# Altium schematic sheet POWER_SUPPLY_2.SchDoc: Power Supply
size A3; DocumentNumber: 9; SheetNumber: 9; SheetTotal: 12
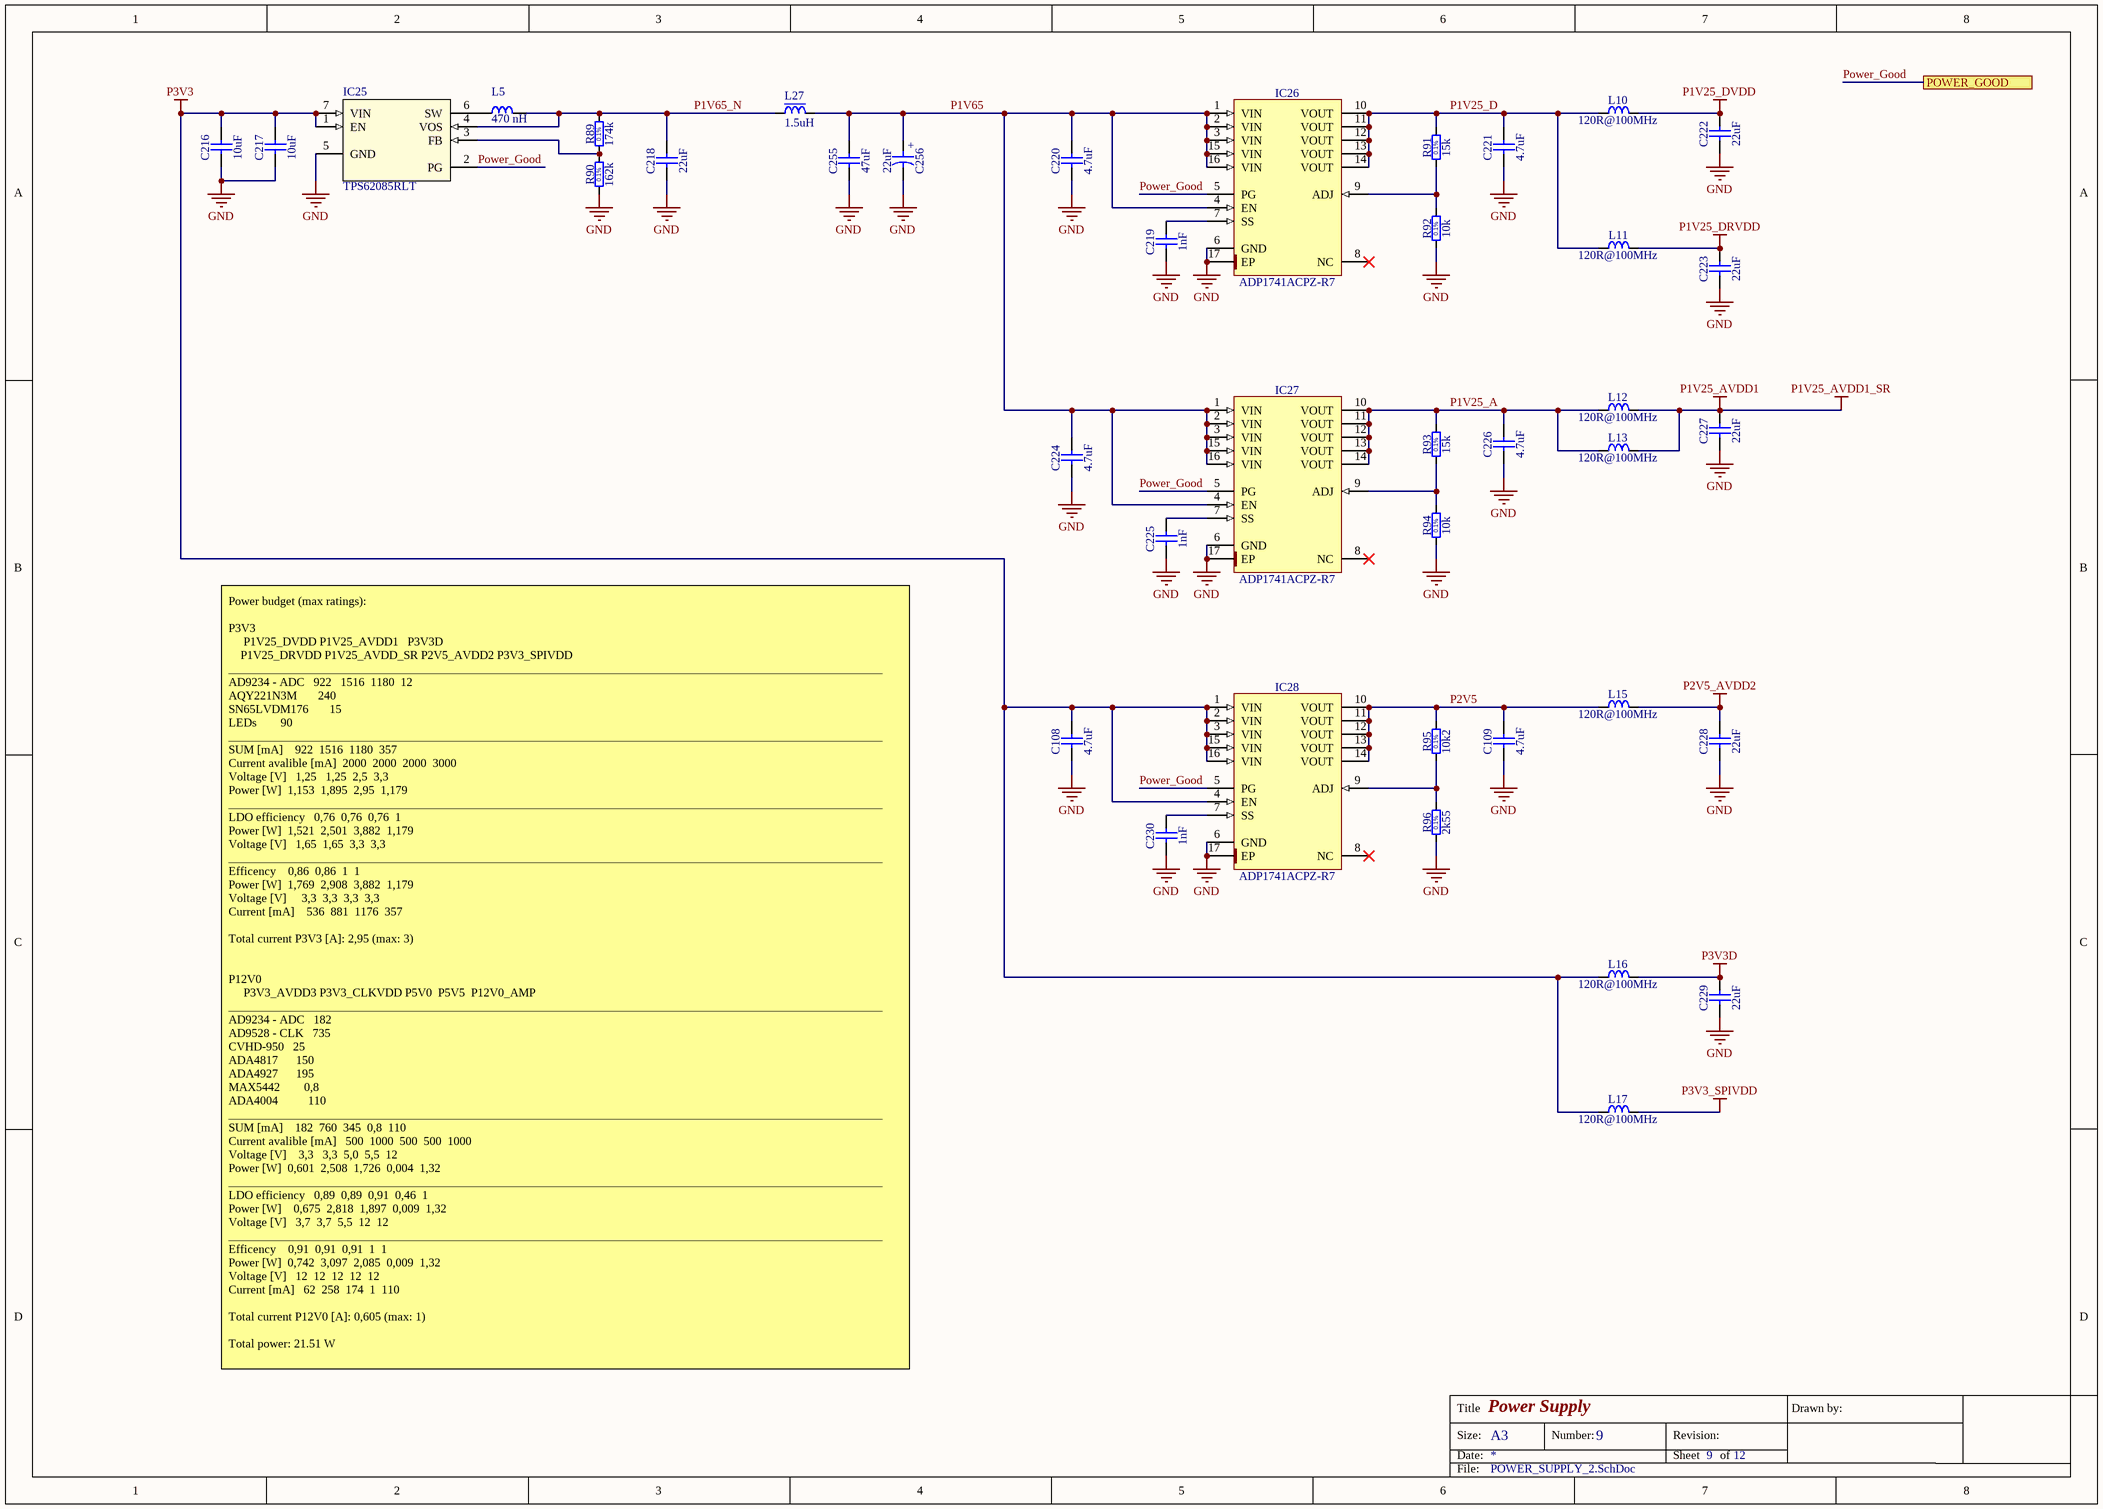
[diagram p0: POWER_SUPPLY_2.SchDoc]

## Parts
C108  4.7uF  [CAPC1709X95N]
C109  4.7uF  [CAPC1709X95N]
C216  10uF  [CAPC1608X87N]
C217  10uF  [CAPC1608X87N]
C218  22uF  [CAPC2012X95N]
C219  1nF  [CAPC0603X33N]
C220  4.7uF  [CAPC1709X95N]
C221  4.7uF  [CAPC1709X95N]
C222  22uF  [CAPC1709X100N]
C223  22uF  [CAPC1709X100N]
C224  4.7uF  [CAPC1709X95N]
C225  1nF  [CAPC0603X33N]
C226  4.7uF  [CAPC1709X95N]
C227  22uF  [CAPC1709X100N]
C228  22uF  [CAPC1709X100N]
C229  22uF  [CAPC1709X100N]
C230  1nF  [CAPC0603X33N]
C255  47uF  [CAPC3225X270N]
C256  22uF  [CAPMP3528X210N]
IC25  TPS62085RLT  [RLT0007A]
IC26  ADP1741ACPZ-R7  [QFN65P400X400X100-17N-S225]
IC27  ADP1741ACPZ-R7  [QFN65P400X400X100-17N-S225]
IC28  ADP1741ACPZ-R7  [QFN65P400X400X100-17N-S225]
L5  470 nH  [IND_IHLP-1212AE]
L10  120R@100MHz  [INDC1608X65N]
L11  120R@100MHz  [INDC1608X65N]
L12  120R@100MHz  [INDC1608X65N]
L13  120R@100MHz  [INDC1608X65N]
L15  120R@100MHz  [INDC1608X65N]
L16  120R@100MHz  [INDC1608X65N]
L17  120R@100MHz  [INDC1608X65N]
L27  1.5uH  [IND_SPM4020]
R89  174k  [RESC2012X60N]
R90  162k  [RESC2012X60N]
R91  15k  [RESC1608X55N]
R92  10k  [RESC1608X55N]
R93  15k  [RESC1608X55N]
R94  10k  [RESC1608X55N]
R95  10k2  [RESC1608X55N]
R96  2k55  [RESC1608X55N]

## Ports
POWER_GOOD

## Nets
GND: C108.1 C109.1 C216.1 C217.1 C218.1 C219.1 C220.1 C221.1 C222.1 C223.1 C224.1 C225.1 C226.1 C227.1 C228.1 C229.1 C230.1 C255.1 C256.2 IC25.5(GND) IC26.6(GND) IC26.17(EP) IC27.6(GND) IC27.17(EP) IC28.6(GND) IC28.17(EP) R90.1 R92.1 R94.1 R96.1
P1V25_AVDD1: C227.2 L12.2 L13.2  [also labelled P1V25_AVDD1_SR]
P1V25_DRVDD: C223.2 L11.2
P1V25_DVDD: C222.2 L10.2
P2V5_AVDD2: C228.2 L15.2
P3V3: C108.2 C216.2 C217.2 IC25.1(EN) IC25.7(VIN) IC28.1(VIN) IC28.2(VIN) IC28.3(VIN) IC28.4(EN) IC28.15(VIN) IC28.16(VIN) L16.1 L17.1
P3V3_SPIVDD: L17.2
P3V3D: C229.2 L16.2
P1V25_A: C226.2 IC27.10(VOUT) IC27.11(VOUT) IC27.12(VOUT) IC27.13(VOUT) IC27.14(VOUT) L12.1 L13.1 R93.2
P1V25_D: C221.2 IC26.10(VOUT) IC26.11(VOUT) IC26.12(VOUT) IC26.13(VOUT) IC26.14(VOUT) L10.1 L11.1 R91.2
P1V65: C220.2 C224.2 C255.2 C256.1 IC26.1(VIN) IC26.2(VIN) IC26.3(VIN) IC26.4(EN) IC26.15(VIN) IC26.16(VIN) IC27.1(VIN) IC27.2(VIN) IC27.3(VIN) IC27.4(EN) IC27.15(VIN) IC27.16(VIN) L27.2
P1V65_N: C218.2 IC25.4(VOS) L5.1 L27.1 R89.2
P2V5: C109.2 IC28.10(VOUT) IC28.11(VOUT) IC28.12(VOUT) IC28.13(VOUT) IC28.14(VOUT) L15.1 R95.2
Power_Good: IC25.2(PG) IC26.5(PG) IC27.5(PG) IC28.5(PG) ; port POWER_GOOD
NetC219_2: C219.2 IC26.7(SS)
NetC225_2: C225.2 IC27.7(SS)
NetC230_2: C230.2 IC28.7(SS)
NetIC25_3: IC25.3(FB) R89.1 R90.2
NetIC25_6: IC25.6(SW) L5.2
NetIC26_9: IC26.9(ADJ) R91.1 R92.2
NetIC27_9: IC27.9(ADJ) R93.1 R94.2
NetIC28_9: IC28.9(ADJ) R95.1 R96.2

Not connected (* = marked no-connect by the designer): IC26 8(NC)*; IC27 8(NC)*; IC28 8(NC)*

## Notes on the sheet
- Power budget (max ratings):
  P3V3
  P1V25_DVDD	P1V25_AVDD1			P3V3D
  P1V25_DRVDD	P1V25_AVDD_SR	P2V5_AVDD2	P3V3_SPIVDD
  _____________________________________________________________________________________________________________
  AD9234 - ADC	  922 		1516		1180		12
  AQY221N3M							240
  SN65LVDM176							15
  LEDs								90
  _____________________________________________________________________________________________________________
  SUM [mA]	   922		1516		1180		357
  Current avalible [mA]  2000		2000		2000		3000
  Voltage [V]	  1,25 		1,25		2,5		3,3
  Power [W]		1,153		1,895		2,95		1,179
  _____________________________________________________________________________________________________________
  LDO efficiency	  0,76		0,76		0,76		1
  Power [W]		1,521		2,501		3,882		1,179
  Voltage [V]	  1,65		1,65		3,3		3,3
  _____________________________________________________________________________________________________________
  Efficency		  0,86		0,86		1		1
  Power [W]		1,769		2,908		3,882		1,179
  Voltage [V]	    3,3		3,3		3,3		3,3
  Current [mA]	   536		881		1176		357
  Total current P3V3 [A]: 2,95 (max: 3)
  P12V0
  P3V3_AVDD3	P3V3_CLKVDD	P5V0		P5V5		P12V0_AMP	_____________________________________________________________________________________________________________
  AD9234 - ADC	  182
  AD9528 - CLK			735
  CVHD-950			25
  ADA4817						150
  ADA4927						195
  MAX5442								0,8
  ADA4004										110
  _____________________________________________________________________________________________________________
  SUM [mA]	   182		760		345		0,8		110
  Current avalible [mA]   500		1000		500		500		1000
  Voltage [V]	   3,3 		3,3		5,0		5,5		12
  Power [W]		0,601		2,508		1,726		0,004		1,32
  _____________________________________________________________________________________________________________
  LDO efficiency	  0,89		0,89		0,91		0,46		1
  Power [W]	 	 0,675		2,818		1,897		0,009		1,32
  Voltage [V]	  3,7		3,7		5,5		12		12
  _____________________________________________________________________________________________________________
  Efficency		  0,91		0,91		0,91		1		1
  Power [W]		0,742		3,097		2,085		0,009		1,32
  Voltage [V]	  12		12		12		12		12
  Current [mA]	  62		258		174		1		110
  Total current P12V0 [A]: 0,605 (max: 1)
  Total power: 21.51 W
- Title
- Size:
- Date:
- A3
- Number:
- Revision:
- Sheet
- of
- Drawn by:
- File:
- (in symbol CTE3528-21_22UF_10V_10%_LESR0700) +
- (in symbol R0603_2K55_0.1%_0.063W_10PPM) 0.1%
- (in symbol R0603_10K2_0.1%_0.063W_10PPM) 0.1%
- (in symbol R0603_10K_0.1%_0.063W_10PPM) 0.1%
- (in symbol R0603_15K_0.1%_0.063W_10PPM) 0.1%
- (in symbol R0805_162K_0.1%_0.125W_25PPM) 0.1%
- (in symbol R0805_174K_0.1%_0.125W_25PPM) 0.1%

## Library data of the parts
C108 C109 C220 C221 C224 C226 = CC0603_4.7UF_16V_10%_X5R: Non-polarised capacitor; Part Description: SMD Multilayer Chip Ceramic Capacitor; Manufacturer: GENERIC; Manufacturer1 Part Number: EMK107ABJ475KA-T; Voltage: 16V; TC: X5R; Tolerance: ±10%; Part Number: CC0603_4.7UF_16V_10%_X5R; Component Kind: Standard; Component Type: Standard; Pin Count: 2; Value: 4.7uF; Status: None; Manufacturer Part Number: CC0603_4.7UF_16V_10%_X5R; Case: 0603; Mounted: Yes; Socket: No; SMD: Yes; Sense: No; Manufacturer1 Example: TAIYO YUDEN; Manufacturer1 ComponentHeight: 0.95mm; HelpURL: \\cern.ch\dfs\Applications\Altium\Datasheets\CC0603_X7R_TAIYO-YUDEN_HIGH-VALUE.pdf; Author: CERN DEM JLC; CreateDate: 16.12.2013; LatestRevisionDate: 16.09.2014
C216 C217 = CC0603_10UF_6.3V_20%_X5R: Non-polarised capacitor; Part Description: SMD Multilayer Chip Ceramic Capacitor; Manufacturer: GENERIC; Manufacturer1 Part Number: C0603C106M9PAC; Voltage: 6.3V; TC: X5R; Tolerance: ±20%; Part Number: CC0603_10UF_6.3V_20%_X5R; Component Kind: Standard; Component Type: Standard; Pin Count: 2; Value: 10uF; Status: Preferred; Manufacturer Part Number: CC0603_10uF_6.3V_20%_X5R; Case: 0603; Mounted: Yes; Socket: No; SMD: Yes; Sense: No; Manufacturer1 Example: KEMET; Manufacturer1 ComponentHeight: 0.95mm; HelpURL: \\cern.ch\dfs\Applications\Altium\Datasheets\CC0603_X5R_KEMET.pdf; Author: CERN DEM JLC; CreateDate: 03.12.2007; LatestRevisionDate: 03.12.2007
C218 = CC0805_22UF_6.3V_20%_X5R: Non-polarised capacitor, Low ESR; Part Description: SMD Multilayer Chip Ceramic Capacitor; Manufacturer: TAIYO YUDEN; Voltage: 6.3V; TC: X5R; Tolerance: ±20%; ESR: 1m; Part Number: CC0805_22UF_6.3V_20%_X5R; Component Kind: Standard; Component Type: Standard; Pin Count: 2; Value: 22uF; Status: Preferred; Manufacturer Part Number: JMK212ABJ226MD; Case: 0805; Mounted: Yes; Socket: No; SMD: Yes; Sense: No; Manufacturer1 ComponentHeight: 0.85mm; Author: *
C219 C225 C230 = CC0201_1NF_16V_10%_X5R: Non-polarised capacitor; Part Description: SMD Multilayer Chip Ceramic Capacitor; Manufacturer: GENERIC; Manufacturer1 Part Number: 0201YD102KAT2A; Voltage: 16V; TC: X5R; Tolerance: ±10%; Part Number: CC0201_1NF_16V_10%_X5R; Component Kind: Standard; Component Type: Standard; Pin Count: 2; Value: 1nF; Status: Not Recommended; Manufacturer Part Number: CC0201_1NF_16V_10%_X5R; Case: 0201; Mounted: Yes; Socket: No; SMD: Yes; Sense: No; Manufacturer1 Example: AVX; Manufacturer1 ComponentHeight: 0.33mm; HelpURL: \\cern.ch\dfs\Applications\Altium\Datasheets\CC0201_X5R_AVX.pdf; Author: CERN DEM JLC; CreateDate: 03.12.2007; LatestRevisionDate: 03.12.2007
C222 C223 C227-C229 = CC0603_22UF_6.3V_20%_X5R: Non-polarised capacitor; Part Description: SMD Multilayer Chip Ceramic Capacitor; Manufacturer: GENERIC; Manufacturer1 Part Number: C1608X5R0J226M080AC; Voltage: 6.3V; TC: X5R; Tolerance: ±20%; Part Number: CC0603_22UF_6.3V_20%_X5R; Component Kind: Standard; Component Type: Standard; Pin Count: 2; Value: 22uF; Status: None; Manufacturer Part Number: CC0603_22UF_6.3V_20%_X5R; Case: 0603; Mounted: Yes; Socket: No; SMD: Yes; Sense: No; Manufacturer1 Example: TDK; Manufacturer1 ComponentHeight: 1mm; HelpURL: \\cern.ch\dfs\Applications\Altium\Datasheets\CC0603_X5R_TDK_C.pdf; Author: CERN DEM JLC; CreateDate: 16.12.2013; LatestRevisionDate: 13.09.2016
C255 = CC1210_47UF_10V_20%_X5R: Non-polarised capacitor; Part Description: SMD Multilayer Chip Ceramic Capacitor; Manufacturer: GENERIC; Manufacturer1 Part Number: LMK325BJ476MM-T; Voltage: 10V; TC: X5R; Tolerance: ±20%; Part Number: CC1210_47UF_10V_20%_X5R; Component Kind: Standard; Component Type: Standard; Pin Count: 2; Value: 47uF; Status: None; Manufacturer Part Number: CC1210_47UF_10V_20%_X5R; Case: 1210; Mounted: Yes; Socket: No; SMD: Yes; Sense: No; Manufacturer1 Example: TAIYO YUDEN; Manufacturer1 ComponentHeight: 2.7mm; HelpURL: \\cern.ch\dfs\Applications\Altium\Datasheets\CC1210_X5R_TAIYO-YUDEN_HIGH-VALUE.pdf; Author: CERN DEM JLC; CreateDate: 04.05.2011; LatestRevisionDate: 04.05.2011
C256 = CTE3528-21_22UF_10V_10%_LESR0700: Polarised capacitor; Part Description: Low ESR 0R7 Solid Tantalum Chip Capacitor; Manufacturer: GENERIC; Manufacturer1 Part Number: TPSB226K010R0700; Voltage: 10V; Tolerance: ±10%; Part Number: CTE3528-21_22UF_10V_10%_LESR0700; Component Kind: Standard; Component Type: Standard; Pin Count: 2; Value: 22uF; Status: Preferred; Manufacturer Part Number: CTE3528-21_22UF_10V_10%_LESR0700; Case: B; Mounted: Yes; Socket: No; SMD: Yes; Sense: No; Manufacturer1 Example: AVX; Manufacturer1 ComponentHeight: 2.1mm; HelpURL: \\cern.ch\dfs\Applications\Altium\Datasheets\CTE-LESR_AVX_TPS.pdf; Author: CERN DEM JLC; CreateDate: 05.05.2008; LatestRevisionDate: 20.01.2009
IC25 = TPS62085RLT: 3-A Step-Down Converter With Hiccup Short-Circuit Protection; Manufacturer: Texas Instruments; CompType: IC; PIN_COUNT: 7; PackageReference: RLT0007A; RoHS: Y; RefDes: RefDes; TYPE: TYPE; Value: Value; Manufacturer Part Number: TPS62085RLT
IC26-IC28 = ADP1741ACPZ-R7: 2A, 0.75V to 3.0V Adjustable, Low-Dropout Linear Regulator; Manufacturer: ANALOG DEVICES; PressFit: No; Bonding: No; Part Number: ADP1741ACPZ-R7; Component Kind: Standard; Component Type: Standard; Device: ADP1741ACPZ-R7; PackageDescription: QFN, 0.65mm pitch,square; 4 pin X 4 pin, 4mm X 4mm X 1mm H body (w/thermal tab 2.25 X 2.25mm),  IPC Medium Density; Part Description: 2A, 0.75V to 3.0V Adjustable, Low-Dropout Linear Regulator; Manufacturer Part Number: ADP1741ACPZ-R7; Pin Count: 17; Case: QFN16; Mounted: Yes; Socket: No; SMD: Yes; Sense: No; ComponentHeight: 1mm; HelpURL: \\cern.ch\dfs\Applications\Altium\Datasheets\ADP1741ACPZ-R7.pdf; Author: CERN DEM JLC; CreateDate: 07.02.2012; LatestRevisionDate: 07.02.2012
L5 = IHLP1212AEERR47M11: Inductor, Low DCR Series; Manufacturer: VISHAY; Series Resistance: 15 mOhm; Tolerance: 20%; Saturation  Current: 6.7 A; Value: 470 nH; Manufacturer Part Number: IHLP1212AEERR47M11
L10-L13 L15-L17 = IND0603_MURATA_BLM18SG121TN1D: Inductor; Part Description: SMD EMIFIL Suppression Chip Ferrite Bead; Manufacturer: MURATA; Power: 3A; Resistance: 0.025R; Tolerance: ±25%; Part Number: IND0603_MURATA_BLM18SG121TN1D; Component Kind: Standard; Component Type: Standard; Pin Count: 2; Value: 120R@100MHz; Status: None; Manufacturer Part Number: BLM18SG121TN1D; Case: 0603; Mounted: Yes; Socket: No; SMD: Yes; Sense: No; ComponentHeight: 0.65mm; HelpURL: \\cern.ch\dfs\Applications\Altium\Datasheets\IND0603_MURATA_BLM18S.pdf; Author: CERN DEM JLC; CreateDate: 23.07.2014; LatestRevisionDate: 23.07.2014
L27 = IND_1.5UH_20%_TDK_SPM4020-LR: Inductor With Core; Part Description: SMD Inductor for Power Circuits (Wound Metal), SPM Series; Manufacturer: TDK; Manufacturer Part Number: SPM4020T-1R5M-LR; Power: 6.3A; Resistance: 0.0399R; Tolerance: ±20%; Part Number: IND_1.5UH_20%_TDK_SPM4020-LR; Component Kind: Standard; Component Type: Standard; Footprint: IND_TDK_SPM4020-LR; Pin Count: 2; Value: 1.5uH; Status: None; Mounted: Yes; Socket: No; SMD: Yes; Sense: No; ComponentHeight: 3mm; HelpURL: \\cern.ch\dfs\Applications\Altium\Datasheets\IND_TDK_SPM6530.pdf; Author: CERN DEM MR; CreateDate: 08.11.2016; LatestRevisionDate: 08.11.2016
R89 = R0805_174K_0.1%_0.125W_25PPM: Resistor - 0.1%; Part Description: Thin Film Chip Resistor; Manufacturer: GENERIC; Manufacturer1 Part Number: ERA6AEB1743V; Power: 0.125W; TC: ±25ppm; Part Number: R0805_174K_0.1%_0.125W_25PPM; Component Kind: Standard; Component Type: Standard; Pin Count: 2; Value: 174k; Status: Not recommended; Tolerance: ±0.1%; Manufacturer Part Number: R0805_174K_0.1%_0.125W_25PPM; Case: 0805; Mounted: Yes; Sense: No; Socket: No; SMD: Yes; Manufacturer1 Example: PANASONIC; Manufacturer1 ComponentHeight: 0.6mm; HelpURL: \\cern.ch\dfs\Applications\Altium\Datasheets\R0805_PANASONIC_ERA.pdf; Author: CERN DEM JLC; CreateDate: 20.06.2011; LatestRevisionDate: 20.06.2011
R90 = R0805_162K_0.1%_0.125W_25PPM: Resistor - 0.1%; Part Description: Thin Film Chip Resistor; Manufacturer: GENERIC; Manufacturer1 Part Number: ERA6AEB1623V; Power: 0.125W; TC: ±25ppm; Part Number: R0805_162K_0.1%_0.125W_25PPM; Component Kind: Standard; Component Type: Standard; Pin Count: 2; Value: 162k; Status: Not recommended; Tolerance: ±0.1%; Manufacturer Part Number: R0805_162K_0.1%_0.125W_25PPM; Case: 0805; Mounted: Yes; Sense: No; Socket: No; SMD: Yes; Manufacturer1 Example: PANASONIC; Manufacturer1 ComponentHeight: 0.6mm; HelpURL: \\cern.ch\dfs\Applications\Altium\Datasheets\R0805_PANASONIC_ERA.pdf; Author: CERN DEM JLC; CreateDate: 20.06.2011; LatestRevisionDate: 20.06.2011
R91 R93 = R0603_15K_0.1%_0.063W_10PPM: Resistor - 0.1%; Part Description: Thin Film Chip Resistor; Manufacturer: GENERIC; Manufacturer1 Part Number: RN73C1J15KBTDF; Power: 0.063W; TC: ±10ppm; Part Number: R0603_15K_0.1%_0.063W_10PPM; Component Kind: Standard; Component Type: Standard; Pin Count: 2; Value: 15k; Status: Not recommended; Tolerance: ±0.1%; Manufacturer Part Number: R0603_15K_0.1%_0.063W_10PPM; Case: 0603; Mounted: Yes; Sense: No; Socket: No; SMD: Yes; Manufacturer1 Example: TYCO HOLSWORTHY; Manufacturer1 ComponentHeight: 0.5mm; HelpURL: \\cern.ch\dfs\Applications\Altium\Datasheets\R0603_Tyco_RN73.pdf; Author: CERN DEM JLC; CreateDate: 03.12.2007; LatestRevisionDate: 13.03.2008
R92 R94 = R0603_10K_0.1%_0.063W_10PPM: Resistor - 0.1%; Part Description: Thin Film Chip Resistor; Manufacturer: GENERIC; Manufacturer1 Part Number: RN73C1J10KBTDF; Power: 0.063W; TC: ±10ppm; Part Number: R0603_10K_0.1%_0.063W_10PPM; Component Kind: Standard; Component Type: Standard; Pin Count: 2; Value: 10k; Status: Not recommended; Tolerance: ±0.1%; Manufacturer Part Number: R0603_10K_0.1%_0.063W_10PPM; Case: 0603; Mounted: Yes; Sense: No; Socket: No; SMD: Yes; Manufacturer1 Example: TYCO HOLSWORTHY; Manufacturer1 ComponentHeight: 0.5mm; HelpURL: \\cern.ch\dfs\Applications\Altium\Datasheets\R0603_Tyco_RN73.pdf; Author: CERN DEM JLC; CreateDate: 03.12.2007; LatestRevisionDate: 13.03.2008
R95 = R0603_10K2_0.1%_0.063W_10PPM: Resistor - 0.1%; Part Description: Thin Film Chip Resistor; Manufacturer: GENERIC; Manufacturer1 Part Number: RN73C1J10K2BTDF; Power: 0.063W; TC: ±10ppm; Part Number: R0603_10K2_0.1%_0.063W_10PPM; Component Kind: Standard; Component Type: Standard; Pin Count: 2; Value: 10k2; Status: Not recommended; Tolerance: ±0.1%; Manufacturer Part Number: R0603_10K2_0.1%_0.063W_10PPM; Case: 0603; Mounted: Yes; Sense: No; Socket: No; SMD: Yes; Manufacturer1 Example: TYCO HOLSWORTHY; Manufacturer1 ComponentHeight: 0.5mm; HelpURL: \\cern.ch\dfs\Applications\Altium\Datasheets\R0603_Tyco_RN73.pdf; Author: CERN DEM JLC; CreateDate: 03.12.2007; LatestRevisionDate: 13.03.2008
R96 = R0603_2K55_0.1%_0.063W_10PPM: Resistor - 0.1%; Part Description: Thin Film Chip Resistor; Manufacturer: GENERIC; Manufacturer1 Part Number: RN73C1J2K55BTDF; Power: 0.063W; TC: ±10ppm; Part Number: R0603_2K55_0.1%_0.063W_10PPM; Component Kind: Standard; Component Type: Standard; Pin Count: 2; Value: 2k55; Status: Not recommended; Tolerance: ±0.1%; Manufacturer Part Number: R0603_2K55_0.1%_0.063W_10PPM; Case: 0603; Mounted: Yes; Sense: No; Socket: No; SMD: Yes; Manufacturer1 Example: TYCO HOLSWORTHY; Manufacturer1 ComponentHeight: 0.5mm; HelpURL: \\cern.ch\dfs\Applications\Altium\Datasheets\R0603_Tyco_RN73.pdf; Author: CERN DEM JLC; CreateDate: 03.12.2007; LatestRevisionDate: 13.03.2008